# EAGLE design epic_multi_prog_a (EAGLE 6.4)
ahh
REV: A; TITLE: Epic Multi Programmer

## Sheet 1 of 3: Programming circuit and switches.
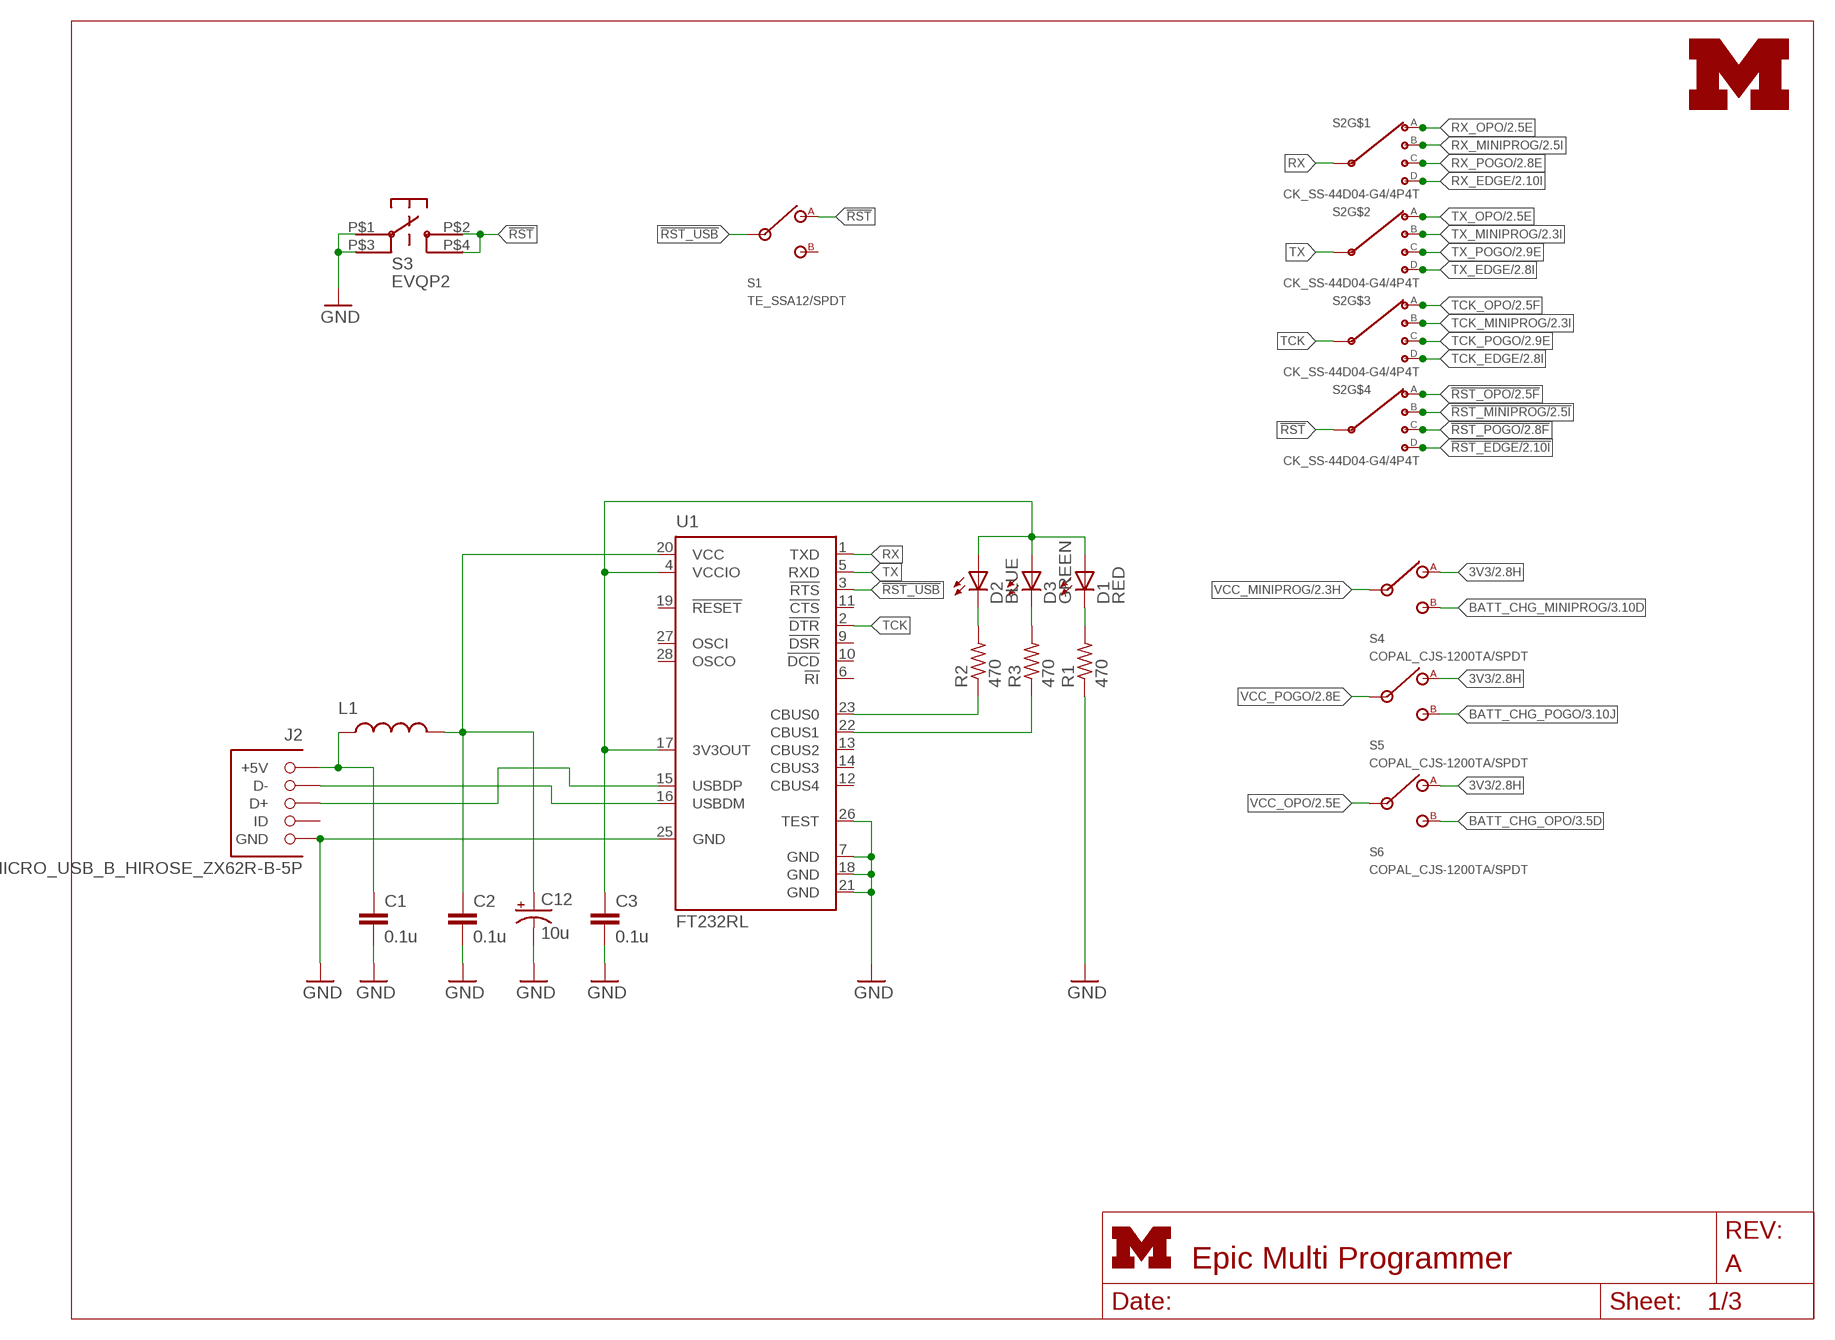
[diagram p0: schematic, sheet 1]

### Parts
C1  0.1u  C-EUC0603  [C0603]
C2  0.1u  C-EUC0603  [C0603]
C3  0.1u  C-EUC0603  [C0603]
C12  10u  CAP_POL1206  [EIA3216]
D1  RED  LED0603  [LED-0603]
D2  BLUE  LED0603  [LED-0603]
D3  GREEN  LED0603  [LED-0603]
J2  MICRO_USB_B_HIROSE_ZX62R-B-5P  [USB_MICRO_B-HIROSE-ZX62R-B-5P]
L1  INDUCTOR0603  [0603]
R1  470  R-US_R0603  [R0603]
R2  470  R-US_R0603  [R0603]
R3  470  R-US_R0603  [R0603]
S1  TE_SSA12/SPDT  [TE_SSA12/SPDT]
S2  CK_SS-44D04-G4/4P4T  [CK_SS-44D04-G4/4P4T]
S3  EVQP2  [EVQP2]
S4  COPAL_CJS-1200TA/SPDT  [COPAL_CJS-1200TA/SPDT]
S5  COPAL_CJS-1200TA/SPDT  [COPAL_CJS-1200TA/SPDT]
S6  COPAL_CJS-1200TA/SPDT  [COPAL_CJS-1200TA/SPDT]
U1  FT232RL  [SSOP28]
U$1  UMICH_SOLID_SMALL  [UMICH_SOLID_75MIL]

### Nets
3V3: C3.1 D1.A D2.A D3.A S4.2(A) S5.2(A) S6.2(A) U1.4(VCCIO) U1.17(3V3OUT) ; also sheet 2,3
!RST: S1.1(A) S2.IND(INPUT) S3.P$2 S3.P$4
!RST_EDGE: S2.D4(D) ; also sheet 2
!RST_MINIPROG: S2.D2(B) ; also sheet 2
!RST_OPO: S2.D1(A) ; also sheet 2
!RST_POGO: S2.D3(C) ; also sheet 2
!RST_USB: S1.IN U1.3(!RTS)
BATT_CHG_MINIPROG: S4.1(B) ; also sheet 3
BATT_CHG_OPO: S6.1(B) ; also sheet 3
BATT_CHG_POGO: S5.1(B) ; also sheet 3
GND: C1.2 C2.2 C3.2 C12.C(-) J2.5(GND) R1.1 S3.P$1 S3.P$3 U1.7(GND) U1.18(GND) U1.21(GND) U1.25(GND) U1.26(TEST) ; also sheet 2,3
N$2: D2.C R2.2
N$3: J2.2(D-) U1.16(USBDM)
N$4: J2.3(D+) U1.15(USBDP)
N$6: C2.1 C12.A(+) L1.2 U1.20(VCC)
N$7: D3.C R3.2
N$8: D1.C R1.2
N$10: R2.1 U1.23(CBUS0)
N$11: R3.1 U1.22(CBUS1)
RX: S2.INA(INPUT) U1.1(TXD)
RX_EDGE: S2.A4(D) ; also sheet 2
RX_MINIPROG: S2.A2(B) ; also sheet 2
RX_OPO: S2.A1(A) ; also sheet 2
RX_POGO: S2.A3(C) ; also sheet 2
TCK: S2.INC(INPUT) U1.2(!DTR)
TCK_EDGE: S2.C4(D) ; also sheet 2
TCK_MINIPROG: S2.C2(B) ; also sheet 2
TCK_OPO: S2.C1(A) ; also sheet 2
TCK_POGO: S2.C3(C) ; also sheet 2
TX: S2.INB(INPUT) U1.5(RXD)
TX_EDGE: S2.B4(D) ; also sheet 2
TX_MINIPROG: S2.B2(B) ; also sheet 2
TX_OPO: S2.B1(A) ; also sheet 2
TX_POGO: S2.B3(C) ; also sheet 2
USB5V: C1.1 J2.1(+5V) L1.1 ; also sheet 3
VCC_MINIPROG: S4.IN ; also sheet 2
VCC_OPO: S6.IN ; also sheet 2
VCC_POGO: S5.IN ; also sheet 2
Unconnected: J2.4(ID) S1.2(B) U1.6(!RI) U1.9(!DSR) U1.10(!DCD) U1.11(!CTS) U1.12(CBUS4) U1.13(CBUS2) U1.14(CBUS3) U1.19(!RESET) U1.27(OSCI) U1.28(OSCO)

## Sheet 2 of 3: Connector
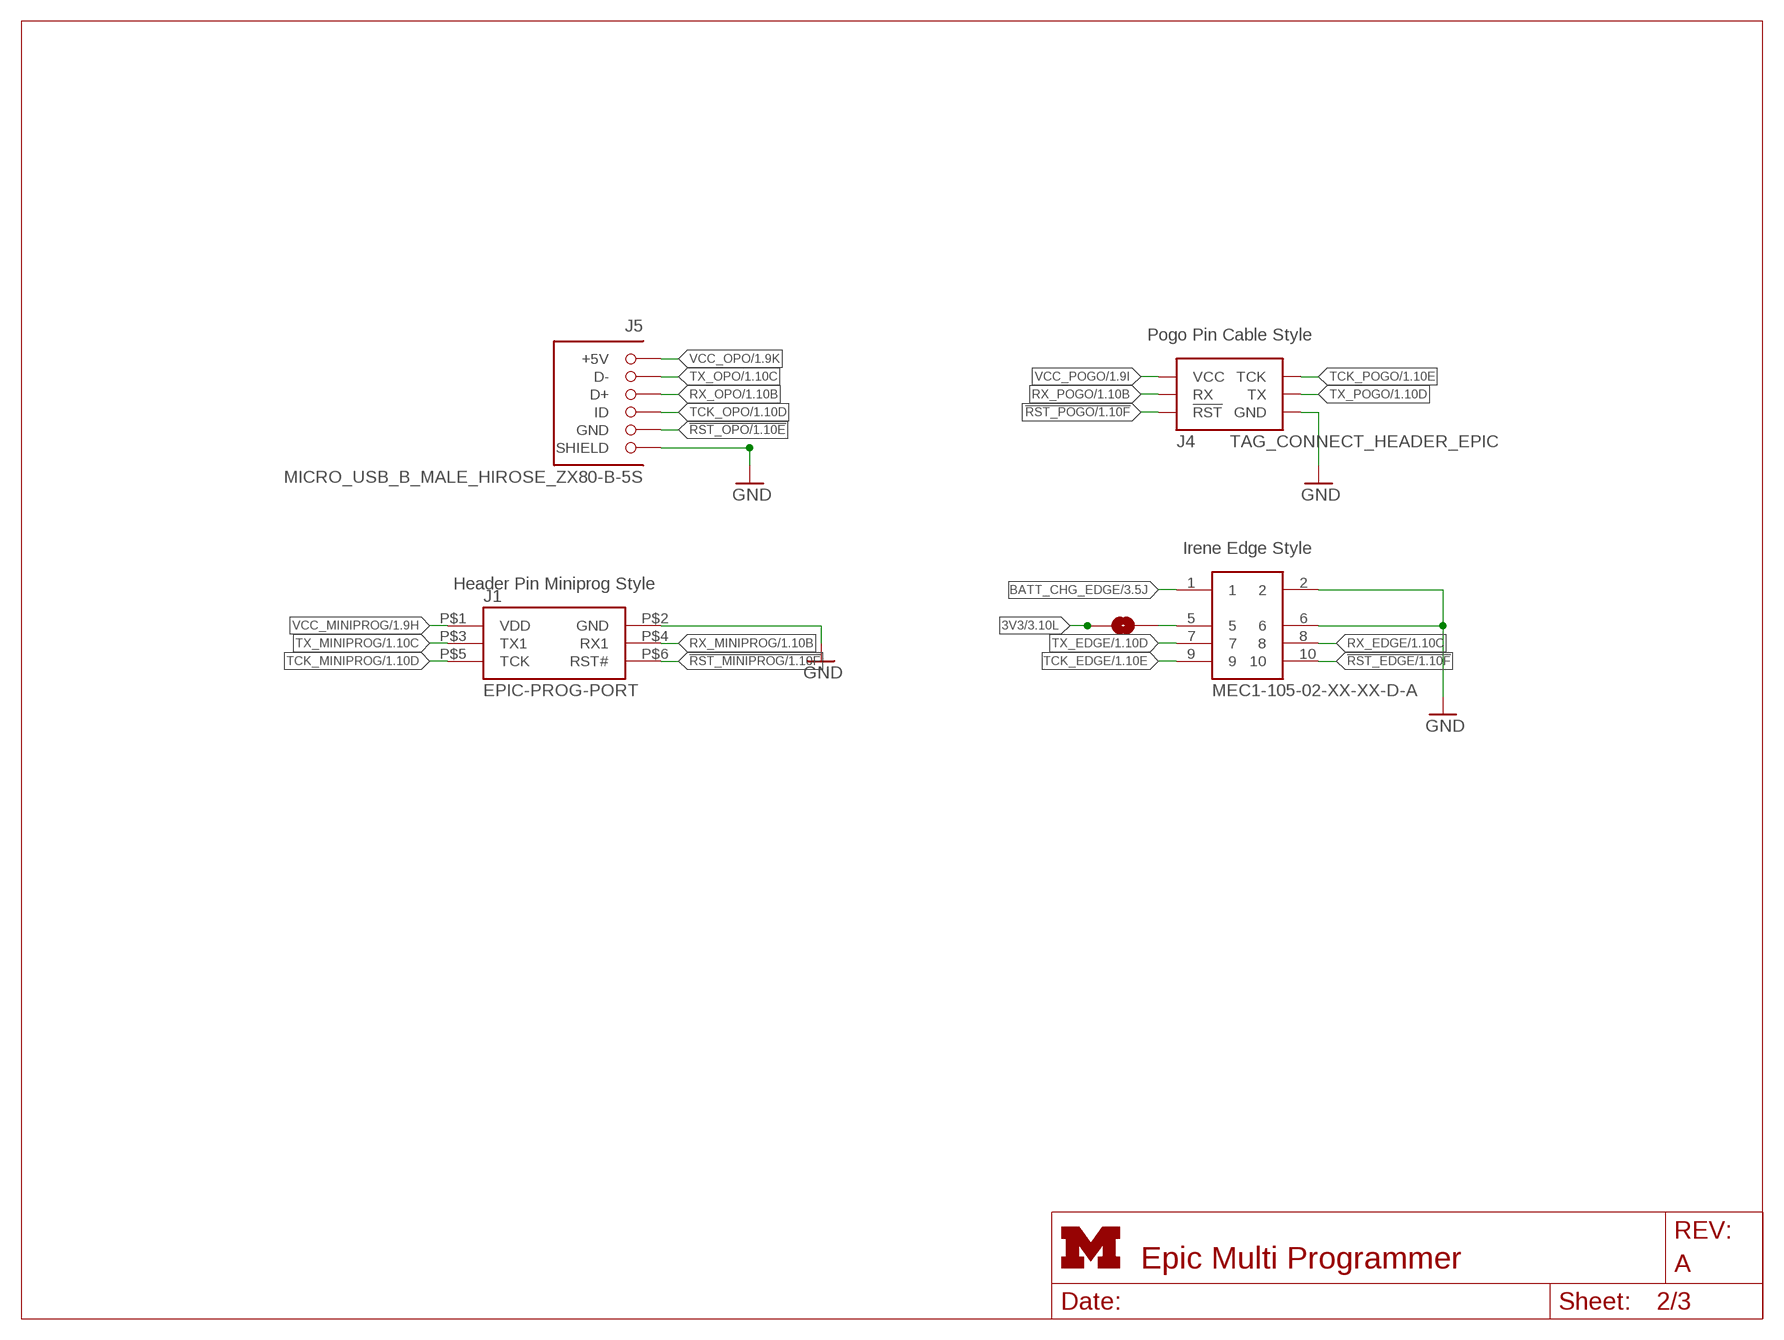
[diagram p1: schematic, sheet 2]

### Parts
J1  EPIC-PROG-PORT  [HEADER2X3X2MM]
J3  MEC1-105-02-XX-XX-D-A  [MEC1-105-02-XX-XX-D-A]
J4  TAG_CONNECT_HEADER_EPIC  [2X3_MALE_SHROUDED_0.100]
J5  MICRO_USB_B_MALE_HIROSE_ZX80-B-5S  [USB_MICRO_B_MALE-HIROSE-ZX80-B-5S]
SJ1  SOLDERJUMPERNO  [SJ_2S-NO]

### Nets
3V3: SJ1.1 ; also sheet 1,3
!RST_EDGE: J3.10 ; also sheet 1
!RST_MINIPROG: J1.P$6(RST#) ; also sheet 1
!RST_OPO: J5.5(GND) ; also sheet 1
!RST_POGO: J4.6(!RST) ; also sheet 1
BATT_CHG_EDGE: J3.1 ; also sheet 3
GND: J1.P$2(GND) J3.2 J3.6 J4.2(GND) J5.SHIELD1(SHIELD) J5.SHIELD2(SHIELD) J5.SHIELD3(SHIELD) J5.SHIELD4(SHIELD) ; also sheet 1,3
N$1: J3.5 SJ1.2
RX_EDGE: J3.8 ; also sheet 1
RX_MINIPROG: J1.P$4(RX1) ; also sheet 1
RX_OPO: J5.3(D+) ; also sheet 1
RX_POGO: J4.4(RX) ; also sheet 1
TCK_EDGE: J3.9 ; also sheet 1
TCK_MINIPROG: J1.P$5(TCK) ; also sheet 1
TCK_OPO: J5.4(ID) ; also sheet 1
TCK_POGO: J4.5(TCK) ; also sheet 1
TX_EDGE: J3.7 ; also sheet 1
TX_MINIPROG: J1.P$3(TX1) ; also sheet 1
TX_OPO: J5.2(D-) ; also sheet 1
TX_POGO: J4.3(TX) ; also sheet 1
VCC_MINIPROG: J1.P$1(VDD) ; also sheet 1
VCC_OPO: J5.1(+5V) ; also sheet 1
VCC_POGO: J4.1(VCC) ; also sheet 1

### Notes on the sheet
- Pogo Pin Cable Style
- Irene Edge Style
- Header Pin Miniprog Style

## Sheet 3 of 3: MAX1555
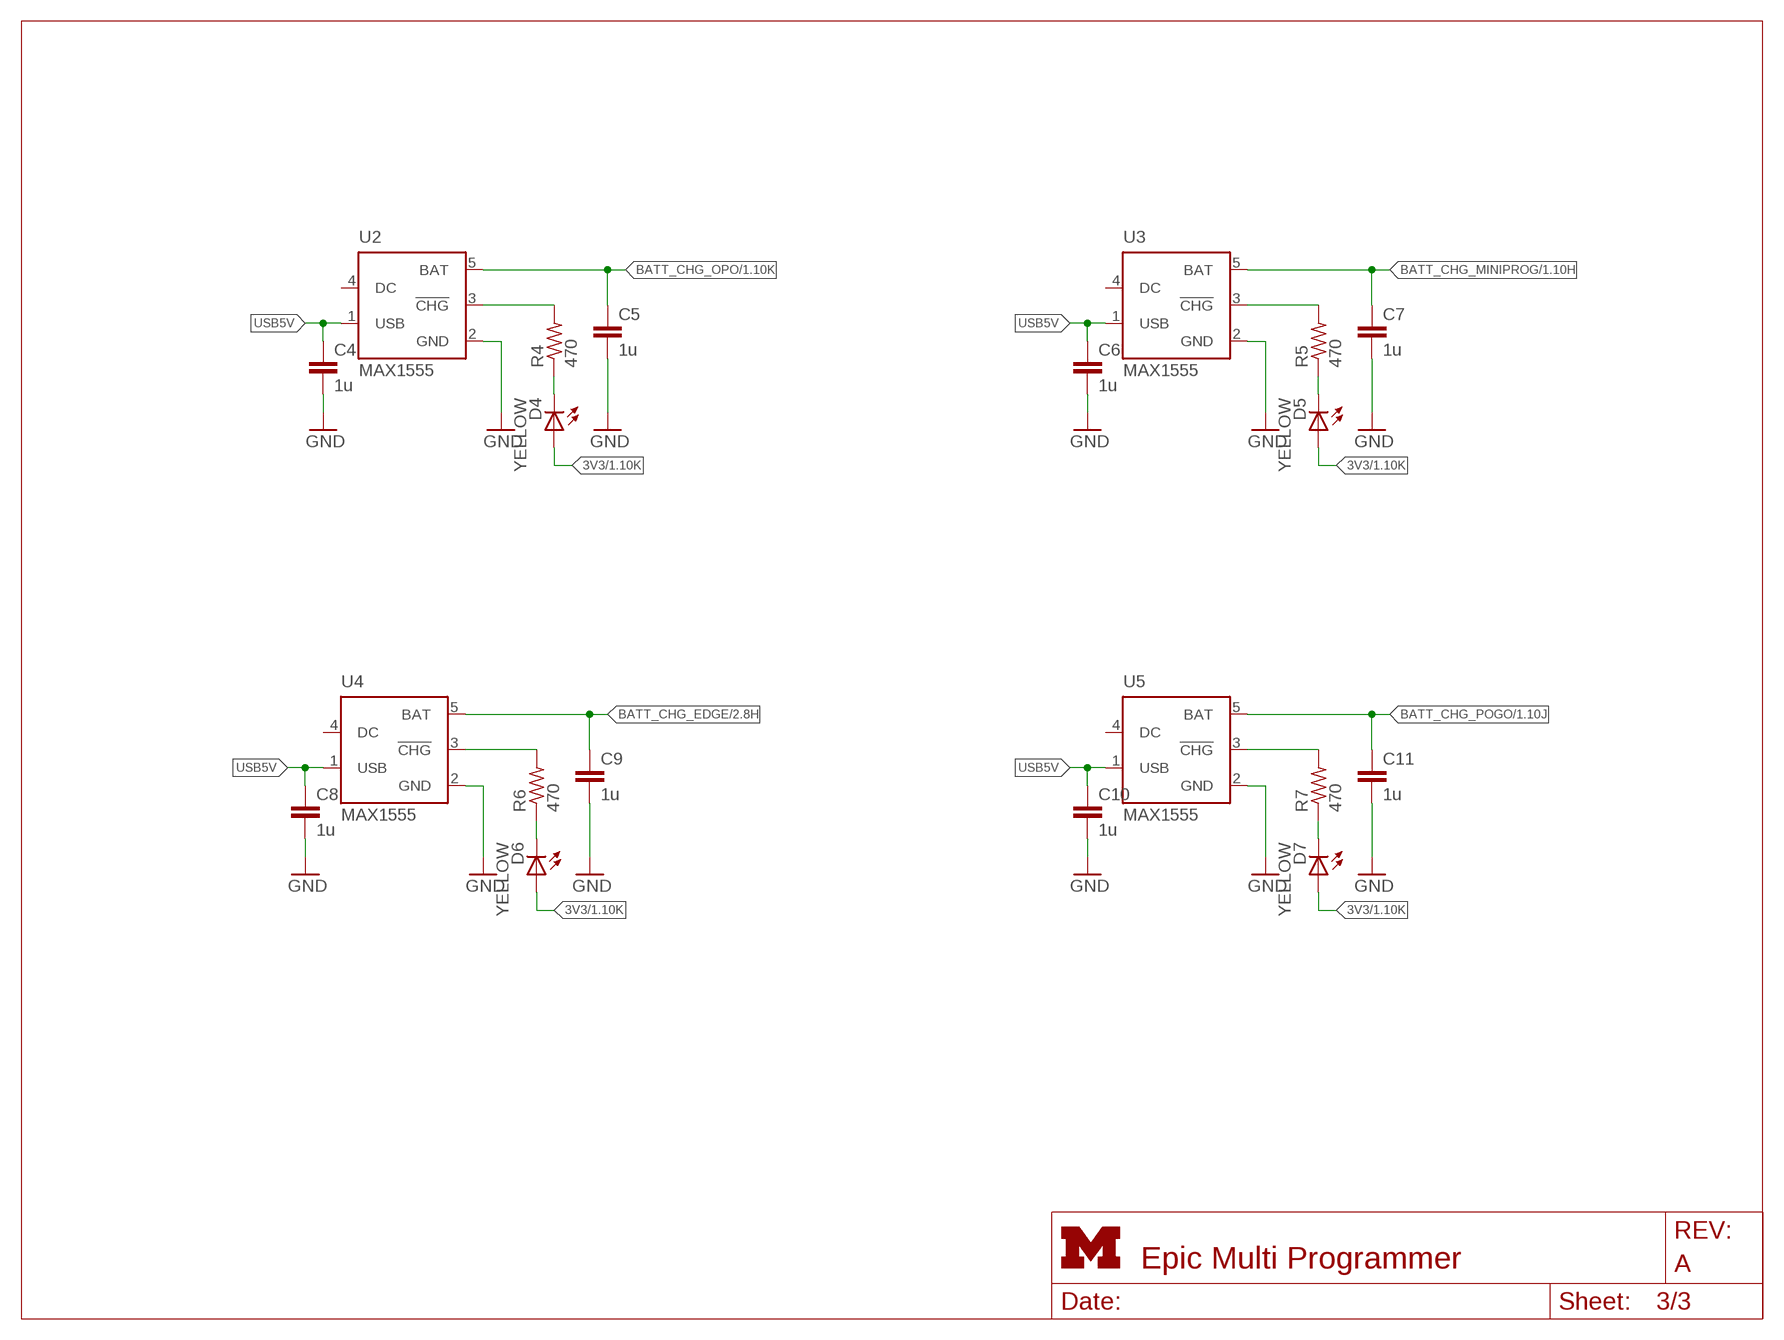
[diagram p2: schematic, sheet 3]

### Parts
C4  1u  C-EUC0603  [C0603]
C5  1u  C-EUC0603  [C0603]
C6  1u  C-EUC0603  [C0603]
C7  1u  C-EUC0603  [C0603]
C8  1u  C-EUC0603  [C0603]
C9  1u  C-EUC0603  [C0603]
C10  1u  C-EUC0603  [C0603]
C11  1u  C-EUC0603  [C0603]
D4  YELLOW  LED0603  [LED-0603]
D5  YELLOW  LED0603  [LED-0603]
D6  YELLOW  LED0603  [LED-0603]
D7  YELLOW  LED0603  [LED-0603]
R4  470  R-US_R0603  [R0603]
R5  470  R-US_R0603  [R0603]
R6  470  R-US_R0603  [R0603]
R7  470  R-US_R0603  [R0603]
U2  MAX1555  [SOT23-5L]
U3  MAX1555  [SOT23-5L]
U4  MAX1555  [SOT23-5L]
U5  MAX1555  [SOT23-5L]

### Nets
3V3: D4.A D5.A D6.A D7.A ; also sheet 1,2
BATT_CHG_EDGE: C9.1 U4.5(BAT) ; also sheet 2
BATT_CHG_MINIPROG: C7.1 U3.5(BAT) ; also sheet 1
BATT_CHG_OPO: C5.1 U2.5(BAT) ; also sheet 1
BATT_CHG_POGO: C11.1 U5.5(BAT) ; also sheet 1
GND: C4.2 C5.2 C6.2 C7.2 C8.2 C9.2 C10.2 C11.2 U2.2(GND) U3.2(GND) U4.2(GND) U5.2(GND) ; also sheet 1,2
N$5: D5.C R5.1
N$9: D4.C R4.1
N$12: R4.2 U2.3(!CHG)
N$16: R5.2 U3.3(!CHG)
N$18: D6.C R6.1
N$19: R6.2 U4.3(!CHG)
N$20: D7.C R7.1
N$21: R7.2 U5.3(!CHG)
USB5V: C4.1 C6.1 C8.1 C10.1 U2.1(USB) U3.1(USB) U4.1(USB) U5.1(USB) ; also sheet 1
Unconnected: U2.4(DC) U3.4(DC) U4.4(DC) U5.4(DC)

## Library data of the parts
C1-C3 = rcl:C-EU: CAPACITOR, European symbol; DIGIKEY: 445-1316-1-ND
C4-C11 = rcl:C-EU: CAPACITOR, European symbol; DIGIKEY: 445-1321-1-ND
C12 = SparkFun:CAP_POL: Capacitor Polarized These are standard SMD and PTH capacitors. Normally 10uF, 47uF, and 100uF in electrolytic and tantalum varieties. Always verify the external diameter of the through hole cap, it varies with capacity, voltage, and manufacturer. The EIA devices should be standard.; DIGIKEY: 478-1655-1-ND
D1-D7 = SparkFun:LED: LEDs Standard schematic elements and footprints for 5mm, 3mm, 1206, and 0603 sized LEDs. 5mm - Spark Fun Electronics SKU : COM-00529 (and others)
J1 = berkeley-epic:EPIC-PROG-PORT
J2 = connector:MICRO_USB_B_HIROSE_ZX62R-B-5P: USB Micro B Connector Rounded side is up.; DIGIKEY: H11574CT-ND
J3 = berkeley-epic:MEC1-105-02-XX-XX-D-A; DIGIKEY: SAM8115-ND
J4 = headers:TAG_CONNECT_HEADER_EPIC: 2x3 Male Shrouded Header 0.100"; DIGIKEY: 3M15451-ND
J5 = connector:MICRO_USB_B_MALE_HIROSE_ZX80-B-5S: CONN PLUG MCR USB B PCB VERT; DIGIKEY: H11612-ND; MOUSER: 798-ZX80-B-5S
L1 = SparkFun:INDUCTOR: Inductors Basic Inductor/Choke - 0603 and 1206. Footprints are not proven and vary greatly between part numbers.; DIGIKEY: 240-2373-1-ND
R1-R7 = rcl:R-US_: RESISTOR, American symbol
S1 = switches:TE_SSA12/SPDT: SWITCH SLIDE SPDT 2POS SSA SER; DIGIKEY: 450-1602-ND
S2 = switches:CK_SS-44D04-G4/4P4T: Through hole 4P4T switch.; DIGIKEY: CKN10389-ND
S3 = berkeley-epic:EVQP2; DIGIKEY: P11084SCT-ND
S4-S6 = switches:COPAL_CJS-1200TA/SPDT: SWITCH SLIDE SPDT SMD J-LEAD; DIGIKEY: 563-1021-2-ND
SJ1 = SparkFun-Passives:SOLDERJUMPER: Solder Jumper Standard SMD solder jumper. Used to automate production. Two varients : Normally Open and Normally Closed are the same, but have different paste layers. NC will have a large amount of paste and should jumper during reflow.
U1 = ftdichip:FT232R: Source: http://www.ftdichip.com/Documents/DataSheets/DS_FT232R_v104.pdf; DIGIKEY: 768-1007-1-ND; MPN: FT232RL; OC_FARNELL: 1146032; OC_NEWARK: 91K9918
U2-U5 = maxim:MAX1555: Dual-Input USB/AC Adapter 1-Cell Li+ Battery Chargers Source: http://www.maxim-ic.com .. MAX1551-MAX1555.pdf; DIGIKEY: MAX1555EZK+TCT-ND; MF: MAXIM; MPN: MAX1555EZK+T; OC_FARNELL: 1628222; OC_NEWARK: 59J2761
U$1 = logos:UMICH_SOLID

## Board
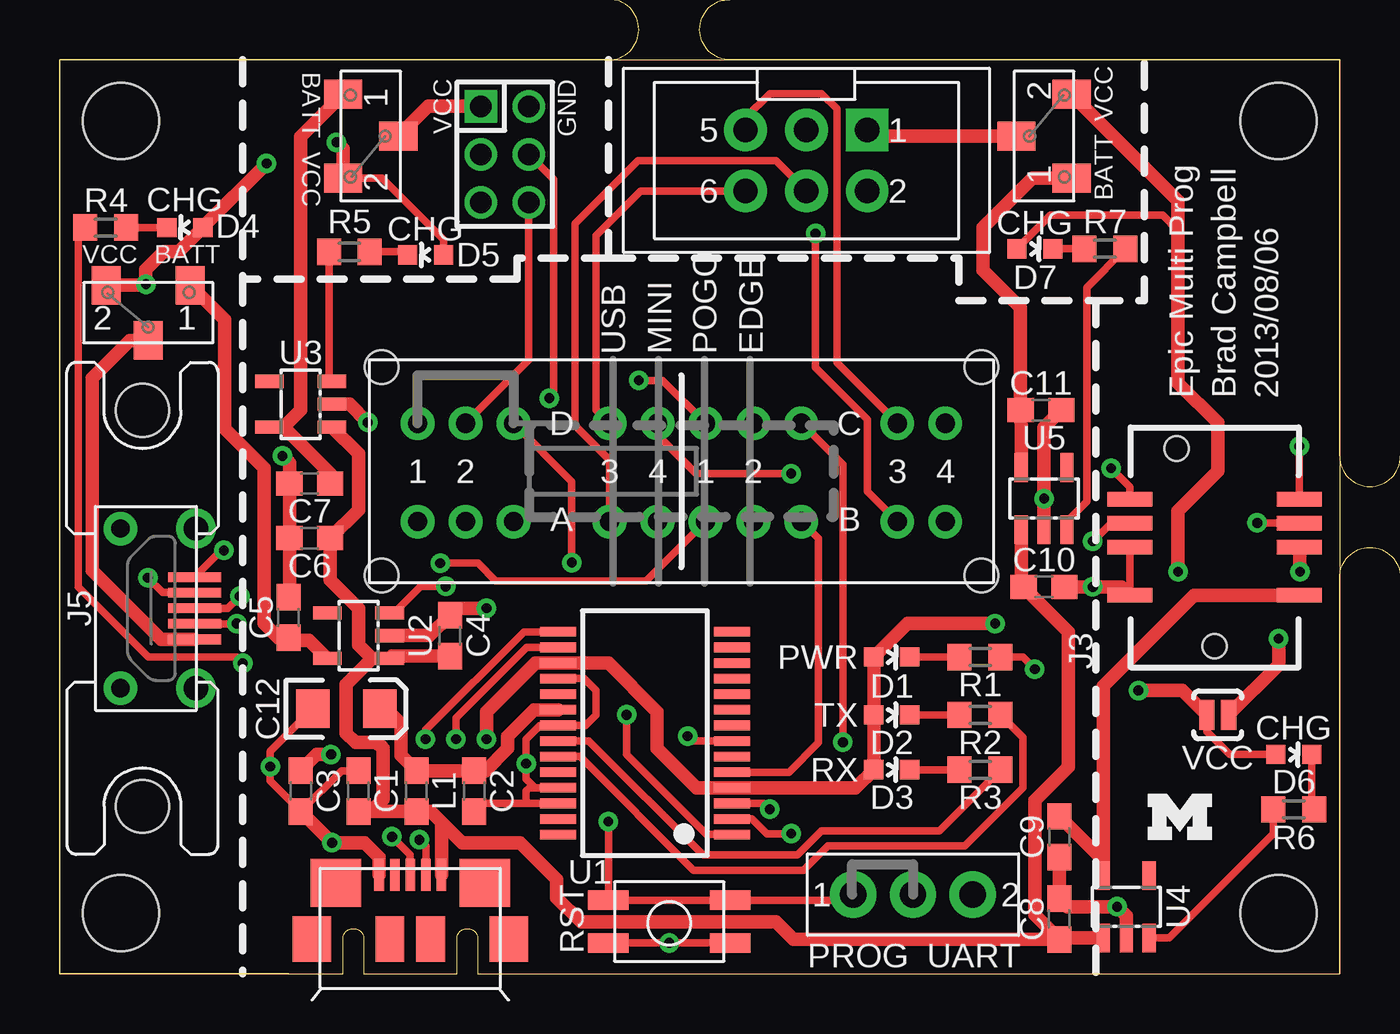
[diagram p3: board, top side]
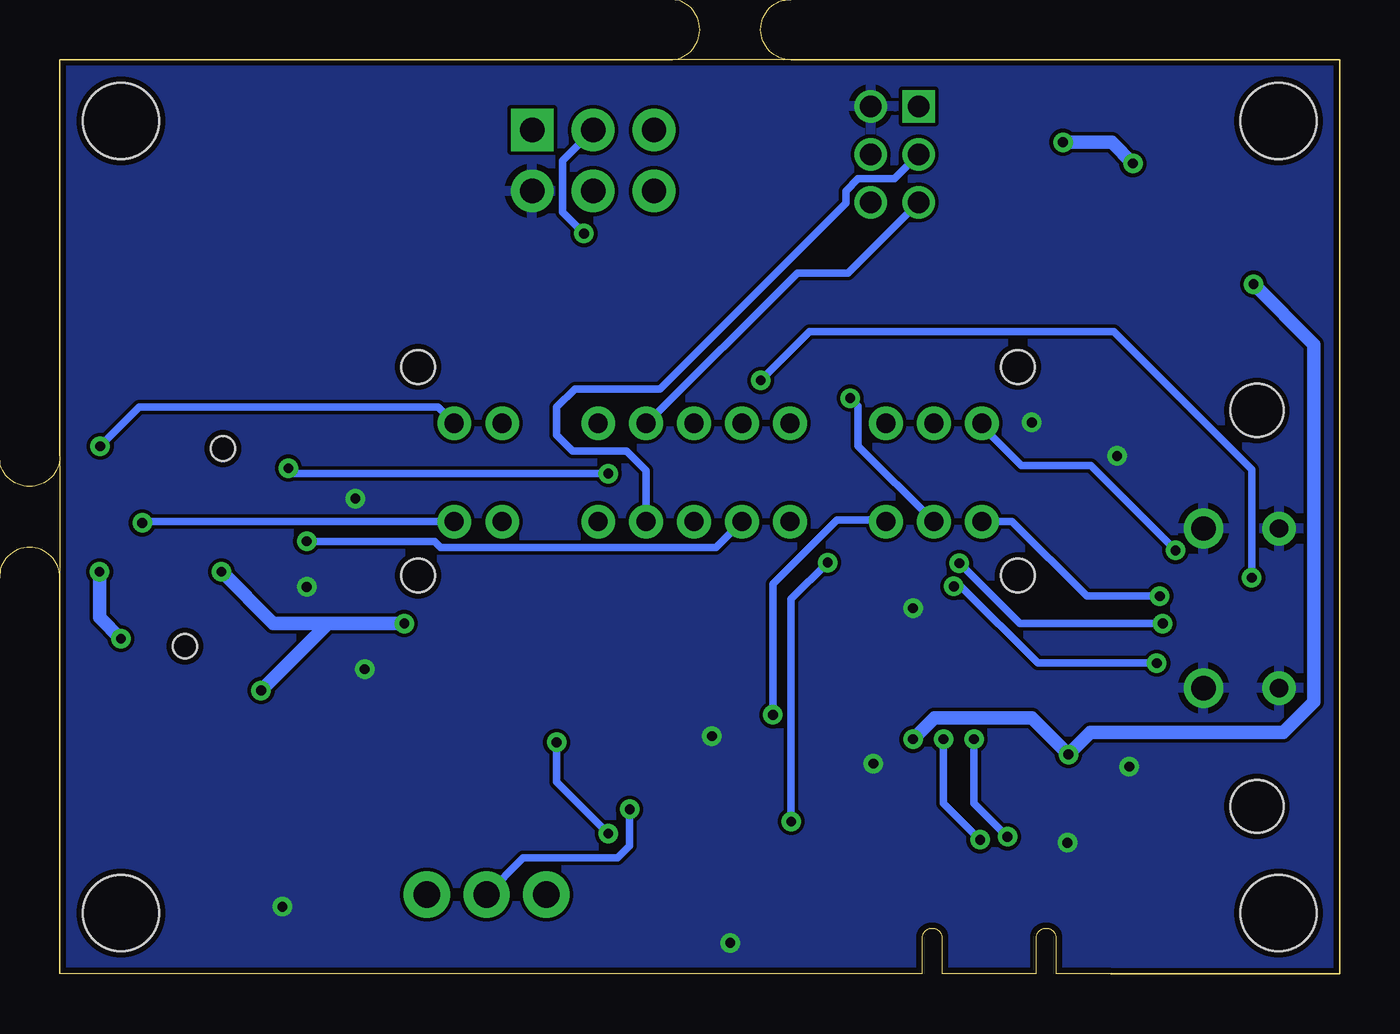
[diagram p4: board, bottom side, seen from below]

Size 53.34 x 38.1 mm. Coordinates in mm from the lower left corner, seen from the top.
Outline: 9.53,0 0,0 0,38.1 53.34,38.1 53.34,0 19.68,0
Copper layers (1*16): Top 0.0178mm / dielectric 59mil / Bottom 0.0178mm
Design rules "default *": minimum track width 6mil, minimum drill 14mil, track to track 6mil, track to pad 6mil, pad to pad 6mil, via to via 6mil, smd to smd 6mil, copper to edge 10mil, drill to drill 16mil, minimum pad ring 8mil, minimum via ring 8mil, stop-mask expansion 3mil, vias tented up to drill 20mil, thermal gap 10mil
Holes 3.17 mm at 2.54,2.54 2.54,35.56 50.8,2.54 50.8,35.56
Milling: 11 lines

### Footprints (pad centres in the part's own frame; a part is rotated, then mirrored left to right if it is on the bottom)
C0603 = smd 1.1 x 1: 1 -0.85,0; 2 0.85,0
EIA3216 = smd 1.4 x 1.6: A 1.4,0; C -1.4,0
LED-0603 = smd 0.8 x 0.8: A 0,-0.75; C 0,0.75
HEADER2X3X2MM = drill 0.9 square: P$1 -1,2 | drill 0.9: P$2 1,2; P$3 -1,0; P$4 1,0; P$5 -1,-2; P$6 1,-2
USB_MICRO_B-HIROSE-ZX62R-B-5P = smd 0.4 x 1.35: 1 1.3,4.125; 2 0.65,4.125; 3 0,4.125; 4 -0.65,4.125; 5 -1.3,4.125 | smd 2.1 x 2: P$1 3.1,3.8; P$2 -3.1,3.8 | smd 1.6 x 1.9: P$3 -4.1,1.45; P$6 4.1,1.45 | smd 1.2 x 1.9: P$4 -0.85,1.45; P$5 0.85,1.45
MEC1-105-02-XX-XX-D-A = smd 0.61 x 1.88: 1 -2,-3.53; 2 -2,3.53; 5 0,-3.53; 6 0,3.53; 7 1,-3.53; 8 1,3.53; 9 2,-3.53; 10 2,3.53 | hole 1.02: -4.12,0; 4.12,1.588
2X3_MALE_SHROUDED_0.100 = drill 1.016 pad 1.778 square: 1 -2.54,-1.27 | drill 1.016 pad 1.778: 2 -2.54,1.27; 3 0,-1.27; 4 0,1.27; 5 2.54,-1.27; 6 2.54,1.27
USB_MICRO_B_MALE-HIROSE-ZX80-B-5S = smd 0.4 x 2.2: 1 -1.3,-1.8; 2 -0.65,-1.8; 3 0,-1.8; 4 0.65,-1.8; 5 1.3,-1.8 | drill 0.762 pad 1.397: SHIELD1 -3.325,1.29; SHIELD3 3.325,1.29 | drill 1.016 pad 1.651: SHIELD2 -3.325,-1.86; SHIELD4 3.325,-1.86 | hole 2.2: -8.252,0.37; 8.252,0.37
0603 = smd 1.1 x 1: 1 -0.85,0; 2 0.85,0
R0603 = smd 1 x 1.1: 1 -0.85,0; 2 0.85,0
TE_SSA12/SPDT = drill 1.092 pad 1.93: 1 -2.489,0; 2 2.489,0; IN 0,0
CK_SS-44D04-G4/4P4T = drill 0.8 pad 1.4: A1 -11,-2.1; A2 -9,-2.1; A3 -3,-2.1; A4 -1,-2.1; B1 1,-2.1; B2 3,-2.1; B3 9,-2.1; B4 11,-2.1; C1 1,2; C2 3,2; C3 9,2; C4 11,2; D1 -11,2; D2 -9,2; D3 -3,2; D4 -1,2; INA -7,-2.1; INB 5,-2.1; INC 5,2; IND -7,2 | hole 1.4: -12.5,4.35; 12.5,4.35; -12.5,-4.35; 12.5,-4.35
EVQP2 = smd 1.676 x 0.813: P$1 -2.54,-0.87; P$2 -2.54,0.908; P$3 2.54,-0.87; P$4 2.54,0.908
COPAL_CJS-1200TA/SPDT = smd 1.2 x 1.6: 1 -1.75,-1.15; 2 1.75,-1.15; IN 0,1.15
SJ_2S-NO = smd 0.635 x 1.27: 1 -0.45,0; 2 0.45,0
SSOP28 = smd 0.4 x 1.5: 1 -4.225,-3.625; 2 -3.575,-3.625; 3 -2.925,-3.625; 4 -2.275,-3.625; 5 -1.625,-3.625; 6 -0.975,-3.625; 7 -0.325,-3.625; 8 0.325,-3.625; 9 0.975,-3.625; 10 1.625,-3.625; 11 2.275,-3.625; 12 2.925,-3.625; 13 3.575,-3.625; 14 4.225,-3.625; 15 4.225,3.625; 16 3.575,3.625; 17 2.925,3.625; 18 2.275,3.625; 19 1.625,3.625; 20 0.975,3.625; 21 0.325,3.625; 22 -0.325,3.625; 23 -0.975,3.625; 24 -1.625,3.625; 25 -2.275,3.625; 26 -2.925,3.625; 27 -3.575,3.625; 28 -4.225,3.625
SOT23-5L = smd 0.55 x 1.2: 1 -0.95,-1.3; 2 0,-1.3; 3 0.95,-1.3; 4 0.95,1.3; 5 -0.95,1.3

### Placement (x,y rotation side)
C1  12.45,7.62 90 top
C2  17.27,7.62 270 top
C3  10.03,7.62 270 top
C4  16.26,14.1 90 top
C5  9.53,14.86 90 top
C6  10.41,18.16 180 top
C7  10.41,20.45 180 top
C8  41.66,2.29 90 top
C9  41.66,5.71 270 top
C10  41.02,16.13 0 top
C11  40.89,23.5 0 top
C12  11.94,11.05 0 top
D1  34.67,13.21 270 top
D2  34.67,10.79 270 top
D3  34.67,8.51 270 top
D4  5.21,31.11 90 top
D5  15.24,29.97 90 top
D6  51.44,9.14 270 top
D7  40.64,30.23 270 top
J1  18.54,34.16 0 top
J2  14.61,0 0 top
J3  48.13,17.78 90 top
J4  31.11,33.91 180 top
J5  3.81,15.24 90 top
L1  14.86,7.62 90 top
R1  38.35,13.21 180 top
R2  38.35,10.79 180 top
R3  38.35,8.51 180 top
R4  1.91,31.11 180 top
R5  12.06,30.1 180 top
R6  51.44,6.86 180 top
R7  43.56,30.23 0 top
S1  35.56,3.3 0 top
S2  25.91,20.95 0 top
S3  25.4,2.16 0 top
S4  12.95,34.92 270 top
S5  41.02,34.92 90 top
S6  3.68,27.56 180 top
SJ1  48.26,10.79 0 top
U1  24.38,10.03 90 top
U2  12.45,14.1 90 top
U3  10.03,23.75 90 top
U4  44.45,2.79 0 top
U5  41.02,19.81 0 top
U$1  45.34,5.59 0 top

### Tracks (layer width: path | path; a pad name or v marks a point on that pad's centre or on a via)
3V3  (via drill 0.41)
  Top 0.305: D5.A 15.99,30.62 13.43,33.17 S4.2 | D7.A 41.29,31.62 45.97,31.62 46.61,30.99 | SJ1.1 47.81,10.1 48.77,9.14 D6.A
  Top 0.559: v11.3,9.14 10.71,9.14 C3.1 | v38.99,14.61 35.32,14.61 D1.A D2.A D3.A 33.17,7.76 U1.4 26.53,7.76 24.89,9.4 24.89,10.92 22.86,12.95 U1.17 19.82,12.96 17.78,10.92 v17.78,9.78 | SJ1.1 46.79,11.81 v44.96,11.81 | S5.2 46.61,32.24 46.61,30.99 46.61,24.64 48.26,22.99 48.26,20.95 46.61,19.3 v46.61,16.76 | S4.2 11.8,34.4 v11.53,34.67 | 2.03,28.71 S6.2 3.54,28.71 v3.58,28.75 3.58,29.36 4.32,30.1 4.94,30.1 D4.A 5.96,31.13 v8.61,33.78
  Bottom 0.559: v17.78,9.78 16.89,10.67 12.83,10.67 v11.3,9.14 10.39,10.06 2.34,10.06 1.07,11.33 1.07,26.24 v3.58,28.75 | v44.96,11.81 42.16,14.61 v38.99,14.61 44.45,14.61 v46.61,16.76 | v11.53,34.67 9.5,34.67 v8.61,33.78
!RST  (via drill 0.41)
  Top 0.305: S1.1 32.84,3.07 S3.P$4 S3.P$2 v22.86,6.35 | v21.34,17.14 21.34,20.53 S2.IND
  Bottom 0.305: v22.86,6.35 22.86,15.62 v21.34,17.14
!RST_EDGE  (via drill 0.41)
  Top 0.305: S2.D4 24.91,22.46 26.52,20.85 v30.48,20.85 | v43.81,21.08 44.6,20.29 J3.10
  Bottom 0.305: v30.48,20.85 43.59,20.85 v43.81,21.08
!RST_MINIPROG
  Top 0.305: S2.D2 19.54,25.59 J1.P$6
!RST_OPO  (via drill 0.41)
  Top 0.305: J5.5 6.72,17.65 v6.83,17.65
  Bottom 0.305: v6.83,17.65 10.36,21.18 13.26,21.18 14.91,22.83 S2.D1
!RST_POGO
  Top 0.305: S2.D3 22.35,23.51 22.35,30.79 24.21,32.64 J4.6
!RST_USB  (via drill 0.41)
  Top 0.305: v29.59,6.86 29.34,7.11 U1.3
  Bottom 0.305: S1.IN 34.04,4.83 30.1,4.83 29.59,5.33 v29.59,6.86
BATT_CHG_EDGE
  Top 0.559: C9.1 43.5,4.72 | 43.5,4.72 U4.5 | J3.1 47.28,15.78 43.5,12 43.5,4.72
BATT_CHG_MINIPROG
  Top 0.559: U3.5 9.33,22.8 | 9.33,22.8 10.03,23.5 10.03,34.9 S4.1 | C7.1 11.26,20.87 9.33,22.8
BATT_CHG_OPO
  Top 0.559: U2.5 10.38,13.91 9.62,13.91 C5.1 9.11,14.01 8.51,14.61 8.51,21.08 6.86,22.73 6.86,27.28 S6.1
BATT_CHG_POGO
  Top 0.559: U5.5 40.07,22.76 C11.1 40.04,27.77 38.48,29.34 38.48,31.11 40.54,33.17 S5.1
GND  (via drill 0.41)
  Top 0.305: 19.56,7.11 19.43,7.24 19.43,7.62 19.57,7.76 U1.25 19.8,7.76 19.43,8.13 v19.43,8.76 19.43,9.78 20.01,10.36 U1.21 21.91,10.36 22.35,10.79 22.35,11.81 21.86,12.31 U1.18 | 19.56,7.11 U1.26 | C1.2 11.73,8.47 C3.2 8.76,8.04 8.76,9.27 C12.C | C2.2 17.61,7.11 19.56,7.11 | U1.7 26.36,9.71 v26.16,9.91 | J3.6 J3.2 | R1.1 40.13,13.21 v40.64,12.7 | S3.P$3 v25.4,1.29 S3.P$1
  Top 0.559: J2.5 13.3,4.86 12.7,5.46 v11.34,5.46 C3.2 | C9.2 C8.2 42,2.79 v44.07,2.79 44.45,2.41 U4.2 | U5.2 v41.02,19.81 41.02,22.77 C11.2 | U2.2 15.41,14.1 C4.2 16.55,15.24 v17.78,15.24 | C5.2 9.56,15.88 C6.2 C7.2 9.56,21.3 v9.27,21.59 | C10.2 v43.05,16.13 44.25,16.13 J3.2 | U3.2 12.06,23.75 v12.83,22.99
  other vias: 8.76,8.64
  pour Bottom: -2.54,-2.54 -2.54,40.64 55.88,40.64 55.88,-2.54
N$1  (via drill 0.41)
  Top 0.559: 51.69,17.75 v51.69,16.76 | v50.8,13.97 50.8,12.88 SJ1.2
  Top 0.61: J3.5 51.69,17.75
  Bottom 0.559: v51.69,16.76 51.69,14.86 v50.8,13.97
N$2
  Top 0.305: D2.C R2.2
N$3  (via drill 0.41)
  Top 0.305: J2.2 15.26,5.32 v14.99,5.59 | v16.51,9.78 16.51,10.67 19.45,13.61 U1.16
  Bottom 0.305: v14.99,5.59 16.51,7.11 v16.51,9.78
N$4  (via drill 0.41)
  Top 0.305: U1.15 19.34,14.26 15.24,10.16 v15.24,9.78 | J2.3 14.61,4.95 v13.84,5.71
  Bottom 0.305: v15.24,9.78 15.24,7.62 15.24,7.49 15.24,7.11 v13.84,5.71
N$5
  Top 0.305: R5.1 14.49,30.1 D5.C
N$6
  Top 0.305: 13.59,11.05 C12.A
  Top 0.559: U1.20 19.77,11.01 18.67,9.91 18.67,9.4 17.74,8.47 C2.1 L1.2 14.22,9.11 14.22,10.41 13.59,11.05
N$7
  Top 0.305: D3.C R3.2
N$8
  Top 0.305: D1.C R1.2
N$9
  Top 0.305: R4.1 D4.C
N$10
  Top 0.305: U1.23 21.68,9.06 26.42,4.32 30.99,4.32 32,5.33 37.72,5.33 40.13,7.75 40.13,9.87 R2.1
N$11
  Top 0.305: U1.22 22.04,9.71 26.8,4.95 30.73,4.95 31.75,5.97 36.66,5.97 R3.1
N$12  (via drill 0.41)
  Top 0.305: 13.4,15.05 U2.3 13.93,15.05 15.04,16.15 v16.08,16.15 | v7.62,12.95 7.37,13.21 3.68,13.21 0.76,16.13 0.76,30.82 R4.2
  Bottom 0.305: v7.62,12.95 12.57,12.95 15.77,16.15 v16.08,16.15
N$16
  Top 0.305: R5.2 11.21,24.82 U3.3
N$18
  Top 0.305: D6.C 52.19,6.96 R6.1
N$19
  Top 0.305: U4.3 46.24,1.49 50.59,5.84 R6.2
N$20
  Top 0.305: R7.1 D7.C
N$21
  Top 0.305: U5.3 41.97,18.86 42.8,19.68 42.8,28.61 R7.2
RX  (via drill 0.41)
  Top 0.305: U1.1 26.96,5.81 23.62,9.14 v23.62,10.79
  Bottom 0.305: v23.62,10.79 23.62,16.26 20.95,18.92 18.98,18.92 S2.INA
RX_EDGE  (via drill 0.41)
  Top 0.305: v43.05,18.03 43.8,18.78 J3.8
  Bottom 0.305: S2.A4 25.98,17.78 37.47,17.78 37.72,18.03 v43.05,18.03
RX_MINIPROG  (via drill 0.41)
  Top 0.305: J1.P$4 20.57,33.13 20.57,24.18 v20.4,24
  Bottom 0.305: v20.4,24 20.07,23.67 20.07,22.01 S2.A2
RX_OPO  (via drill 0.41)
  Top 0.305: J5.3 6.99,15.24 v7.49,15.75
  Bottom 0.305: v7.49,15.75 10.54,15.75 13.65,18.86 S2.A1
RX_POGO
  Top 0.305: S2.A3 22.91,21.41 21.46,22.86 21.46,31.27 24.11,33.91 29.84,33.91 J4.4
TCK  (via drill 0.41)
  Top 0.305: S2.INC 32.64,21.22 v32.64,9.65 | U1.2 28.85,6.46 29.46,5.84 v30.48,5.84
  Bottom 0.305: v30.48,5.84 32.64,8 v32.64,9.65
TCK_EDGE  (via drill 0.41)
  Top 0.305: v51.66,22 J3.9
  Bottom 0.305: v51.66,22 50.04,23.62 37.58,23.62 S2.C4
TCK_MINIPROG
  Bottom 0.305: S2.C2 28.86,22.95 22.61,29.21 20.5,29.21 J1.P$5
TCK_OPO  (via drill 0.41)
  Top 0.305: J5.4 4.28,15.89 v3.66,16.51 | S2.C1 25.12,24.74 v24.13,24.74
  Bottom 0.305: v3.66,16.51 3.66,21.03 9.4,26.77 22.1,26.77 v24.13,24.74
TCK_POGO
  Top 0.305: S2.C3 32.38,25.48 32.38,36.07 31.75,36.7 29.59,36.7 28.57,35.69 J4.5
TX
  Top 0.305: U1.5 30.38,8.41 31.62,9.65 31.62,18.14 S2.INB
TX_EDGE  (via drill 0.41)
  Top 0.305: v49.91,18.8 51.65,18.8 J3.7
  Bottom 0.305: S2.B4 49.85,18.86 v49.91,18.8
TX_MINIPROG
  Bottom 0.305: S2.B2 28.91,20.98 29.72,21.79 31.98,21.79 32.64,22.45 32.64,23.62 31.88,24.38 28.32,24.38 20.57,32.13 20.57,32.64 20.07,33.15 18.56,33.15 J1.P$3
TX_OPO  (via drill 0.41)
  Top 0.305: J5.2 7.35,14.59 v7.37,14.61 | S2.B1 24.44,16.38 18.16,16.38 17.42,17.12 v15.85,17.12
  Bottom 0.305: v7.37,14.61 13.34,14.61 v15.85,17.12
TX_POGO  (via drill 0.41)
  Top 0.305: S2.B3 33.66,20.11 33.66,23.11 31.5,25.27 v31.5,30.86
  Bottom 0.305: v31.5,30.86 32.38,31.75 32.38,33.91 J4.3
USB5V
  Top 0.559: J2.1 15.9,6.32 | 12.95,6.77 L1.1 15.46,6.77 15.9,6.32 | 12.95,6.77 C1.1 | 12.95,6.77 13.46,7.28 13.46,9.4 13.21,9.65 12.32,9.65 11.94,10.03 11.94,12.06 13.02,13.15 | U3.1 12.45,21.69 12.45,19.34 C6.1 11.26,16.42 12.45,15.24 12.45,13.72 13.02,13.15 | 15.9,6.32 16.76,5.46 19.18,5.46 20.7,3.94 20.7,3.17 21.72,2.16 29.84,2.16 30.57,1.44 C8.1 | C8.1 41.71,1.49 U4.1 | C8.1 40.64,2.45 40.64,7.24 42.04,8.64 42.04,14.26 C10.1 40.07,16.23 U5.1 | 13.02,13.15 U2.1 13.85,13.25 C4.1
VCC_MINIPROG
  Top 0.559: S4.IN 15.34,36.16 J1.P$1
VCC_OPO
  Top 0.559: S6.IN 2.91,26.41 1.35,24.84 1.35,16.82 4.22,13.94 J5.1
VCC_POGO
  Top 0.559: J4.1 33.91,34.92 S5.IN

### Text on the board
tPlace: VCC | BATT | VCC | GND | BATT | VCC | CHG | CHG | CHG | VCC | BATT | USB | MINI | POGO | EDGE | Epic Multi Prog | Brad Campbell | 2013/08/06 | PWR | TX | VCC | CHG | RX | RST | PROG | UART